# Altium schematic sheet 06_LMS7002M_Power.SchDoc: LMS7002M power supply
size A3 portrait; Organization: Lime Microsystems; Address1: Surrey Tech Centre; Address2: Guildford GU2 7YG; Address3: Surrey; Address4: United Kingdom; Revision: v1.3; SheetNumber: 6; SheetTotal: 9; PageSetup: Record=PageOptions|CenterHorizontal=True|CenterVertical=True|PrintScale=0.73|XCorrection=1.00|YCorrection=1.00|PrintKind=0|BorderSize=5000000|LeftOffset=0|BottomOffset=0|Orientation=1|PaperLength=2970|PaperWidth=2100|Scale=100|PaperSource=7|PrintQuality=-3|MediaType=1|DitherType=10|PrintScaleMode=1|PaperKind=A4|PaperIndex=9
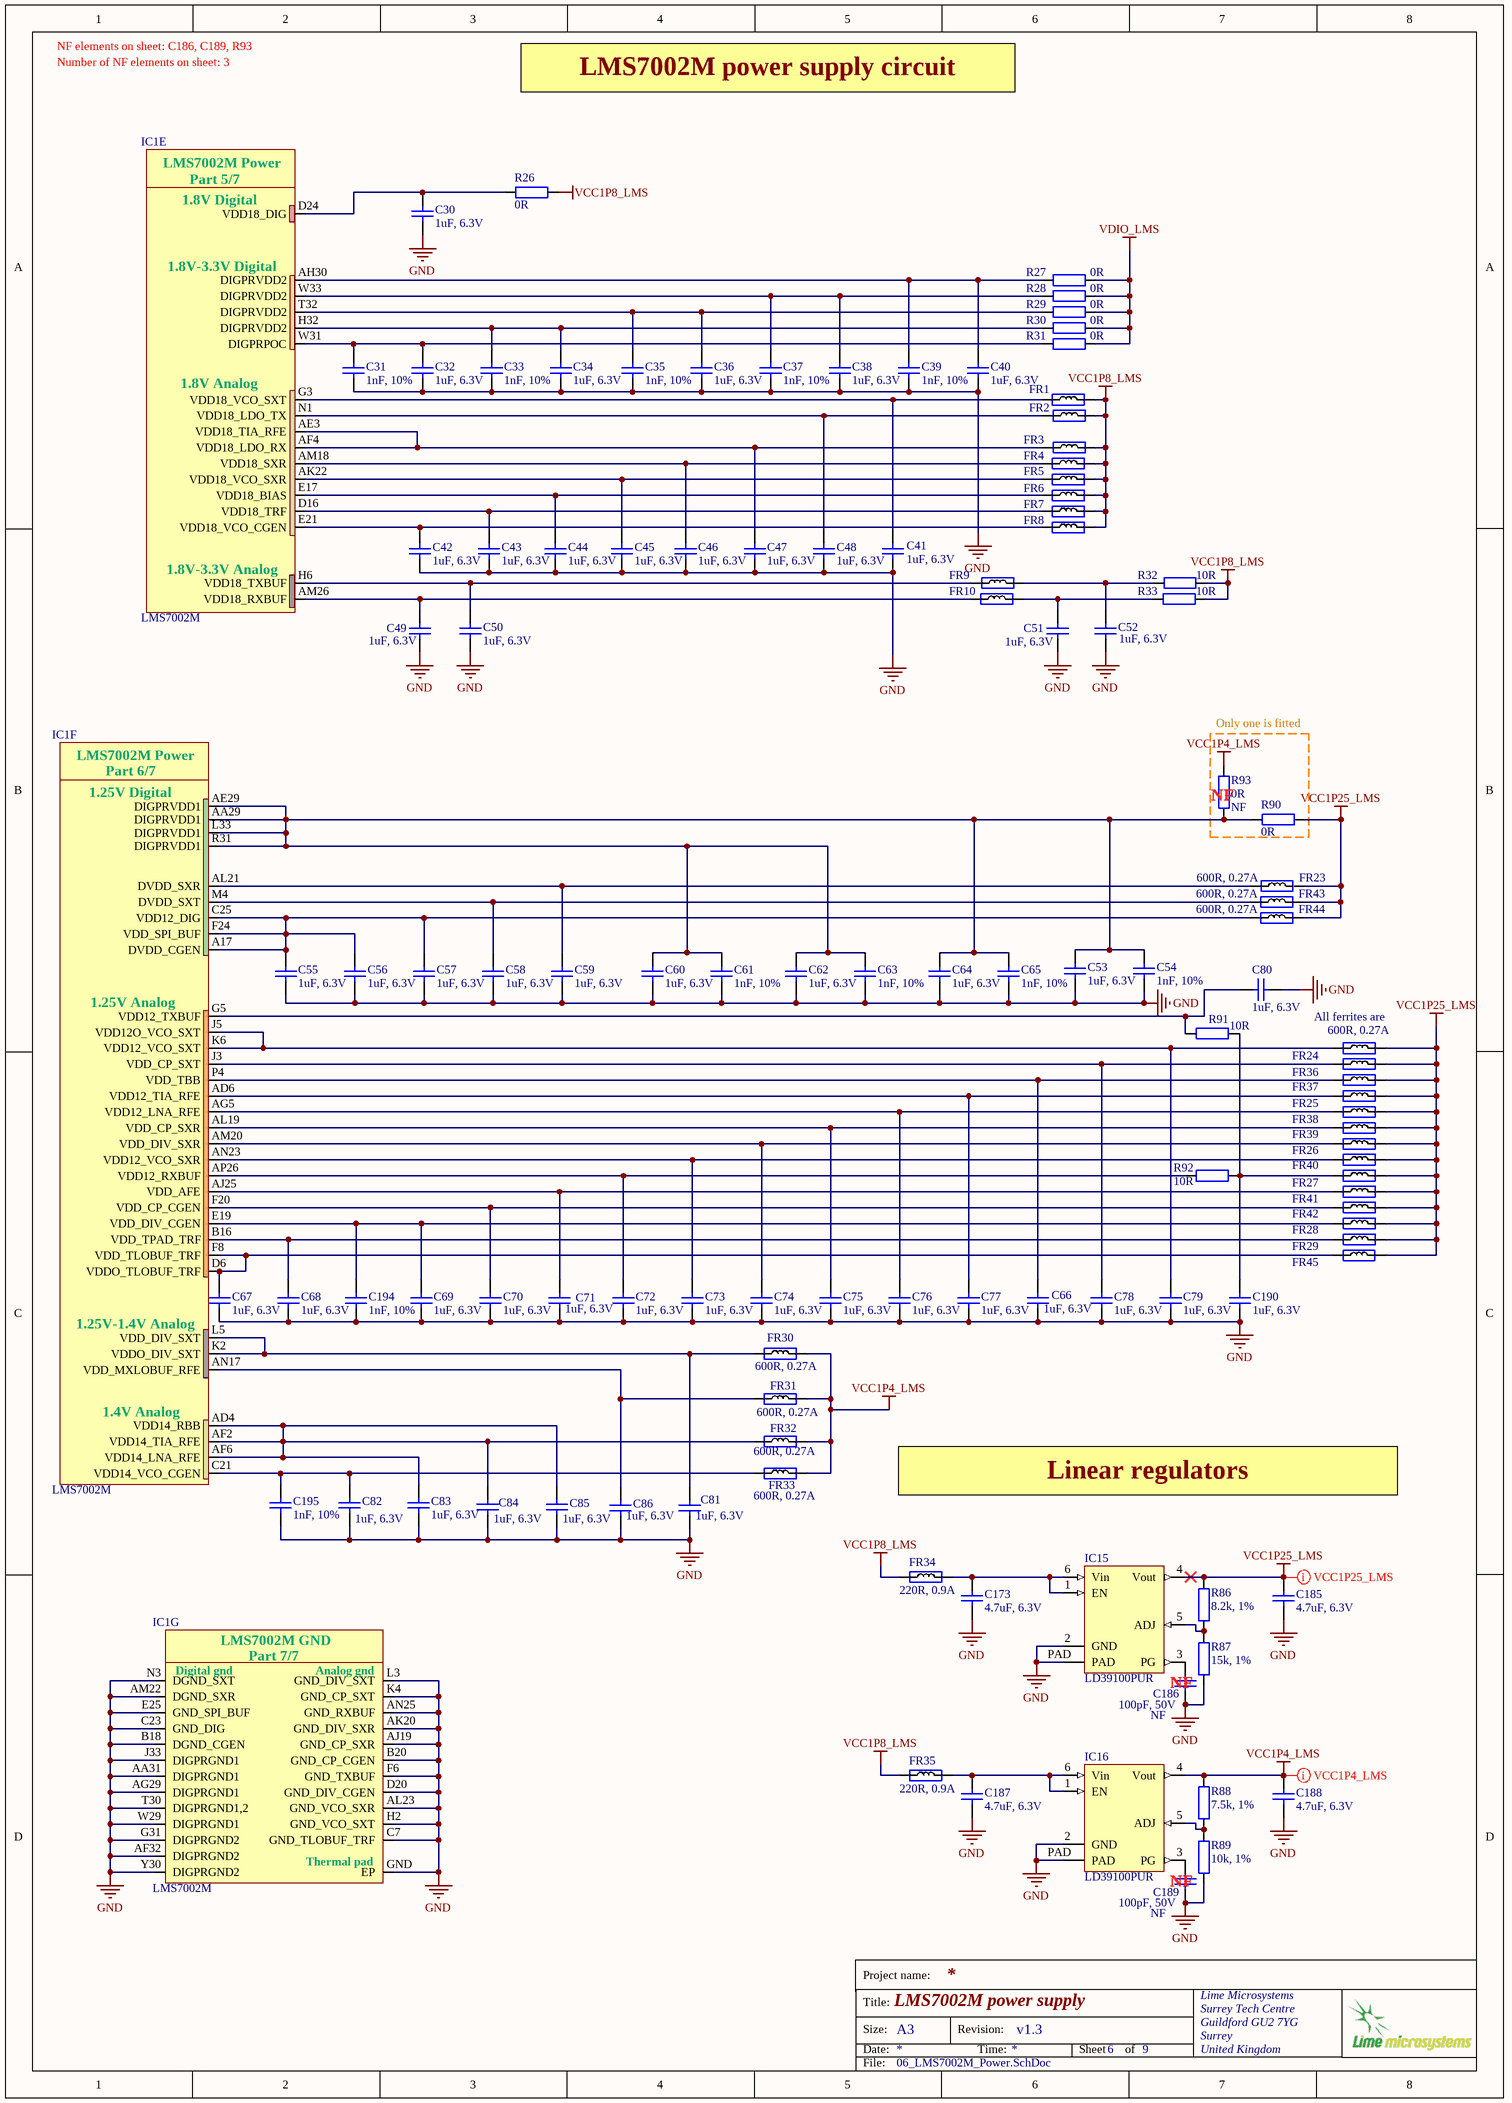
[diagram p0: 06_LMS7002M_Power.SchDoc]

## Parts
C30  1uF, 6.3V  [CAP0201]
C31  1nF, 10%  [CAP0201]
C32  1uF, 6.3V  [CAP0201]
C33  1nF, 10%  [CAP0201]
C34  1uF, 6.3V  [CAP0201]
C35  1nF, 10%  [CAP0201]
C36  1uF, 6.3V  [CAP0201]
C37  1nF, 10%  [CAP0201]
C38  1uF, 6.3V  [CAP0201]
C39  1nF, 10%  [CAP0201]
C40  1uF, 6.3V  [CAP0201]
C41  1uF, 6.3V  [CAP0201]
C42  1uF, 6.3V  [CAP0201]
C43  1uF, 6.3V  [CAP0201]
C44  1uF, 6.3V  [CAP0201]
C45  1uF, 6.3V  [CAP0201]
C46  1uF, 6.3V  [CAP0201]
C47  1uF, 6.3V  [CAP0201]
C48  1uF, 6.3V  [CAP0201]
C49  1uF, 6.3V  [CAP0201]
C50  1uF, 6.3V  [CAP0201]
C51  1uF, 6.3V  [CAP0201]
C52  1uF, 6.3V  [CAP0201]
C53  1uF, 6.3V  [CAP0201]
C54  1nF, 10%  [CAP0201]
C55  1uF, 6.3V  [CAP0201]
C56  1uF, 6.3V  [CAP0201]
C57  1uF, 6.3V  [CAP0201]
C58  1uF, 6.3V  [CAP0201]
C59  1uF, 6.3V  [CAP0201]
C60  1uF, 6.3V  [CAP0201]
C61  1nF, 10%  [CAP0201]
C62  1uF, 6.3V  [CAP0201]
C63  1nF, 10%  [CAP0201]
C64  1uF, 6.3V  [CAP0201]
C65  1nF, 10%  [CAP0201]
C66  1uF, 6.3V  [CAP0201]
C67  1uF, 6.3V  [CAP0201]
C68  1uF, 6.3V  [CAP0201]
C69  1uF, 6.3V  [CAP0201]
C70  1uF, 6.3V  [CAP0201]
C71  1uF, 6.3V  [CAP0201]
C72  1uF, 6.3V  [CAP0201]
C73  1uF, 6.3V  [CAP0201]
C74  1uF, 6.3V  [CAP0201]
C75  1uF, 6.3V  [CAP0201]
C76  1uF, 6.3V  [CAP0201]
C77  1uF, 6.3V  [CAP0201]
C78  1uF, 6.3V  [CAP0201]
C79  1uF, 6.3V  [CAP0201]
C80  1uF, 6.3V  [CAP0201]
C81  1uF, 6.3V  [CAP0201]
C82  1uF, 6.3V  [CAP0201]
C83  1uF, 6.3V  [CAP0201]
C84  1uF, 6.3V  [CAP0201]
C85  1uF, 6.3V  [CAP0201]
C86  1uF, 6.3V  [CAP0201]
C173  4.7uF, 6.3V  [CAP0402]
C185  4.7uF, 6.3V  [CAP0402]
C186  100pF, 50V  Assembly Info: NF  [CAP0402]
C187  4.7uF, 6.3V  [CAP0402]
C188  4.7uF, 6.3V  [CAP0402]
C189  100pF, 50V  Assembly Info: NF  [CAP0402]
C190  1uF, 6.3V  [CAP0201]
C194  1nF, 10%  [CAP0201]
C195  1nF, 10%  [CAP0201]
FR1  600R, 0.27A  [RES0201]  (value not drawn)
FR2  600R, 0.27A  [RES0201]  (value not drawn)
FR3  600R, 0.27A  [RES0201]  (value not drawn)
FR4  600R, 0.27A  [RES0201]  (value not drawn)
FR5  600R, 0.27A  [RES0201]  (value not drawn)
FR6  600R, 0.27A  [RES0201]  (value not drawn)
FR7  600R, 0.27A  [RES0201]  (value not drawn)
FR8  600R, 0.27A  [RES0201]  (value not drawn)
FR9  600R, 0.27A  [RES0201]  (value not drawn)
FR10  600R, 0.27A  [RES0201]  (value not drawn)
FR23  600R, 0.27A  [RES0201]
FR24  600R, 0.27A  [RES0201]
FR25  600R, 0.27A  [RES0201]  (value not drawn)
FR26  600R, 0.27A  [RES0201]  (value not drawn)
FR27  600R, 0.27A  [RES0201]  (value not drawn)
FR28  600R, 0.27A  [RES0201]  (value not drawn)
FR29  600R, 0.27A  [RES0201]  (value not drawn)
FR30  600R, 0.27A  [RES0201]
FR31  600R, 0.27A  [RES0201]
FR32  600R, 0.27A  [RES0201]
FR33  600R, 0.27A  [RES0201]
FR34  220R, 0.9A  [RES0402]
FR35  220R, 0.9A  [RES0402]
FR36  600R, 0.27A  [RES0201]  (value not drawn)
FR37  600R, 0.27A  [RES0201]  (value not drawn)
FR38  600R, 0.27A  [RES0201]  (value not drawn)
FR39  600R, 0.27A  [RES0201]  (value not drawn)
FR40  600R, 0.27A  [RES0201]  (value not drawn)
FR41  600R, 0.27A  [RES0201]  (value not drawn)
FR42  600R, 0.27A  [RES0201]  (value not drawn)
FR43  600R, 0.27A  [RES0201]
FR44  600R, 0.27A  [RES0201]
FR45  600R, 0.27A  [RES0201]  (value not drawn)
IC1  LMS7002M  [LMS7002M_v5]  (parts E,F,G of 7)
IC15  LD39100PUR  [LD39100PUR]
IC16  LD39100PUR  [LD39100PUR]
R26  0R  [RES0201]
R27  0R  [RES0402]
R28  0R  [RES0402]
R29  0R  [RES0402]
R30  0R  [RES0402]
R31  0R  [RES0402]
R32  10R  [RES0201]
R33  10R  [RES0201]
R86  8.2k, 1%  [RES0402]
R87  15k, 1%  [RES0402]
R88  7.5k, 1%  [RES0402]
R89  10k, 1%  [RES0402]
R90  0R  [RES0402]
R91  10R  [RES0201]
R92  10R  [RES0201]
R93  0R  Assembly Info: NF  [RES0402]

## Blocks framed on the sheet
Only one is fitted: R90 R93

## Nets
GND: C30.2 C31.2 C32.2 C33.2 C34.2 C35.2 C36.2 C37.2 C38.2 C39.2 C40.2 C41.2 C42.2 C43.2 C44.2 C45.2 C46.2 C47.2 C48.2 C49.2 C50.2 C51.2 C52.2 C53.2 C54.2 C55.2 C56.2 C57.2 C58.1 C59.2 C60.2 C61.2 C62.2 C63.2 C64.2 C65.2 C66.2 C67.2 C68.2 C69.2 C70.1 C71.2 C72.2 C73.2 C74.2 C75.2 C76.2 C77.1 C78.2 C79.1 C80.2 C81.2 C82.2 C83.2 C84.2 C85.2 C86.2 C173.1 C185.1 C186.1 C187.1 C188.1 C189.1 C190.1 C194.2 C195.2 IC1.AA31(DIGPRGND1) IC1.AF32(DIGPRGND2) IC1.AG29(DIGPRGND1) IC1.AJ19(GND_CP_SXR) IC1.AK20(GND_DIV_SXR) IC1.AL23(GND_VCO_SXR) IC1.AM22(DGND_SXR) IC1.AN25(GND_RXBUF) IC1.B18(DGND_CGEN) IC1.B20(GND_CP_CGEN) IC1.C7(GND_TLOBUF_TRF) IC1.C23(GND_DIG) IC1.D20(GND_DIV_CGEN) IC1.E25(GND_SPI_BUF) IC1.F6(GND_TXBUF) IC1.G31(DIGPRGND2) IC1.GND(EP) IC1.H2(GND_VCO_SXT) IC1.J33(DIGPRGND1) IC1.K4(GND_CP_SXT) IC1.L3(GND_DIV_SXT) IC1.N3(DGND_SXT) IC1.T30(DIGPRGND1,2) IC1.W29(DIGPRGND1) IC1.Y30(DIGPRGND2) IC15.2(GND) IC15.PAD IC16.2(GND) IC16.PAD R87.1 R89.1
VCC1P4_LMS: C188.2 FR30.2 FR31.2 FR32.2 FR33.2 IC16.4(Vout) R88.2 R93.1
VCC1P8_LMS: FR1.2 FR2.1 FR3.1 FR4.2 FR5.2 FR6.2 FR7.2 FR8.2 FR34.1 FR35.1 R26.2 R32.2 R33.1
VCC1P25_LMS: C185.2 FR23.2 FR24.2 FR25.2 FR26.2 FR27.2 FR28.2 FR29.2 FR36.2 FR37.2 FR38.2 FR39.2 FR40.2 FR41.2 FR42.2 FR43.2 FR44.2 FR45.2 IC15.4(Vout) R86.2 R90.1
VDIO_LMS: R27.1 R28.1 R29.1 R30.1 R31.1
NetC30_1: C30.1 IC1.D24(VDD18_DIG) R26.1
NetC31_1: C31.1 C32.1 IC1.W31(DIGPRPOC) R31.2
NetC33_1: C33.1 C34.1 IC1.H32(DIGPRVDD2) R30.2
NetC35_1: C35.1 C36.1 IC1.T32(DIGPRVDD2) R29.2
NetC37_1: C37.1 C38.1 IC1.W33(DIGPRVDD2) R28.2
NetC39_1: C39.1 C40.1 IC1.AH30(DIGPRVDD2) R27.2
NetC41_1: C41.1 FR1.1 IC1.G3(VDD18_VCO_SXT)
NetC42_1: C42.1 FR8.1 IC1.E21(VDD18_VCO_CGEN)
NetC43_1: C43.1 FR7.1 IC1.D16(VDD18_TRF)
NetC44_1: C44.1 FR6.1 IC1.E17(VDD18_BIAS)
NetC45_1: C45.1 FR5.1 IC1.AK22(VDD18_VCO_SXR)
NetC46_1: C46.1 FR4.1 IC1.AM18(VDD18_SXR)
NetC47_1: C47.1 FR3.2 IC1.AE3(VDD18_TIA_RFE) IC1.AF4(VDD18_LDO_RX)
NetC48_1: C48.1 FR2.2 IC1.N1(VDD18_LDO_TX)
NetC49_1: C49.1 FR10.1 IC1.AM26(VDD18_RXBUF)
NetC50_1: C50.1 FR9.2 IC1.H6(VDD18_TXBUF)
NetC51_1: C51.1 FR10.2 R33.2
NetC52_1: C52.1 FR9.1 R32.1
NetC53_1: C53.1 C54.1 C60.1 C61.1 C62.1 C63.1 C64.1 C65.1 IC1.AA29(DIGPRVDD1) IC1.AE29(DIGPRVDD1) IC1.L33(DIGPRVDD1) IC1.R31(DIGPRVDD1) R90.2 R93.2
NetC55_1: C55.1 C56.1 C57.1 FR44.1 IC1.A17(DVDD_CGEN) IC1.C25(VDD12_DIG) IC1.F24(VDD_SPI_BUF)
NetC58_2: C58.2 FR43.1 IC1.M4(DVDD_SXT)
NetC59_1: C59.1 FR23.1 IC1.AL21(DVDD_SXR)
NetC66_1: C66.1 FR37.1 IC1.P4(VDD_TBB)
NetC67_1: C67.1 FR45.1 IC1.D6(VDDO_TLOBUF_TRF) IC1.F8(VDD_TLOBUF_TRF)
NetC68_1: C68.1 FR29.1 IC1.B16(VDD_TPAD_TRF)
NetC69_1: C69.1 C194.1 FR28.1 IC1.E19(VDD_DIV_CGEN)
NetC70_2: C70.2 FR42.1 IC1.F20(VDD_CP_CGEN)
NetC71_1: C71.1 FR41.1 IC1.AJ25(VDD_AFE)
NetC72_1: C72.1 IC1.AP26(VDD12_RXBUF) R92.1
NetC73_1: C73.1 FR40.1 IC1.AN23(VDD12_VCO_SXR)
NetC74_1: C74.1 FR26.1 IC1.AM20(VDD_DIV_SXR)
NetC75_1: C75.1 FR39.1 IC1.AL19(VDD_CP_SXR)
NetC76_1: C76.1 FR38.1 IC1.AG5(VDD12_LNA_RFE)
NetC77_2: C77.2 FR25.1 IC1.AD6(VDD12_TIA_RFE)
NetC78_1: C78.1 FR36.1 IC1.J3(VDD_CP_SXT)
NetC79_2: C79.2 FR24.1 IC1.J5(VDD12O_VCO_SXT) IC1.K6(VDD12_VCO_SXT)
NetC80_1: C80.1 IC1.G5(VDD12_TXBUF) R91.1
NetC81_1: C81.1 FR30.1 IC1.K2(VDDO_DIV_SXT) IC1.L5(VDD_DIV_SXT)
NetC82_1: C82.1 C195.1 FR33.1 IC1.C21(VDD14_VCO_CGEN)
NetC83_1: C83.1 C84.1 C85.1 FR32.1 IC1.AD4(VDD14_RBB) IC1.AF2(VDD14_TIA_RFE) IC1.AF6(VDD14_LNA_RFE)
NetC86_1: C86.1 FR31.1 IC1.AN17(VDD_MXLOBUF_RFE)
NetC173_2: C173.2 FR34.2 IC15.1(EN) IC15.6(Vin)
NetC186_2: C186.2 IC15.3(PG)
NetC187_2: C187.2 FR35.2 IC16.1(EN) IC16.6(Vin)
NetC189_2: C189.2 IC16.3(PG)
NetC190_2: C190.2 FR27.1 R91.2 R92.2
NetIC15_5: IC15.5(ADJ) R86.1 R87.2
NetIC16_5: IC16.5(ADJ) R88.1 R89.2

## Layout directives
net class VCC1P25_LMS: VCC1P25_LMS
net class VCC1P4_LMS: VCC1P4_LMS

## Notes on the sheet
- Number of NF elements on sheet: 3
- NF elements on sheet: C186, C189, R93
- LMS7002M power supply circuit
- (near R93) NF
- (near FR24) All ferrites are
- Linear regulators
- NF
- Project name:
- Title:
- Size:
- Date:
- A3
- Revision:
- Time:
- Sheet
- of
- File:
- (in symbol LMS7002Mr3, part E) LMS7002M Power; Part 5/7; 1.8V Digital; 1.8V-3.3V Digital; 1.8V Analog; 1.8V-3.3V Analog
- (in symbol LMS7002Mr3, part F) LMS7002M Power; Part 6/7; 1.25V Digital; 1.25V Analog; 1.25V-1.4V Analog; 1.4V Analog
- (in symbol LMS7002Mr3, part G) LMS7002M GND; Part 7/7; Digital gnd; Analog gnd; Thermal pad

## Library data of the parts
C30 C32 C34 C36 C38 C40-C53 C55-C60 C62 C64 C66-C86 C190 = Cap_0402: Manufacturer: TDK Corporation; Manufacturer Part Number 1: JMK063ABJ105MP-F; Part Description: 1µF ±20% 6.3V X5R Ceramic Capacitor -55°C ~ 85°C Surface Mount, MLCC 0201 (0603 Metric) 0.024" L x 0.012" W (0.60mm x 0.30mm); Value: 1uF, 20%; Tolerance: ±20%; Capacitance: 1.0µF; Temperature Coefficient: X5R; Supplier 1: Digi-Key; Supplier Part Number 1: 587-5864-2-ND; Applications: General Purpose; Features: -; Lead Style: -; Ratings: -; Thickness (Max): -; Lead Spacing: -; Height - Seated (Max): -; Size / Dimension: 0.024" L x 0.012" W (0.60mm x 0.30mm); Mounting Type: Surface Mount, MLCC; Operating Temperature: -55°C ~ 85°C; Package / Case: 0201 (0603 Metric); Packaging: Cut Tape (CT); Voltage - Rated: 6.3V; Category: Capacitors; RoHS: RoHS Compliant
C31 C33 C35 C37 C39 C54 C61 C63 C65 C194 C195 = Cap_0402: Manufacturer Part Number 1: C0603X7R1E102K030BA; Manufacturer: TDK Corporation; Part Description: 1000pF ±10% 25V X7R Ceramic Capacitor -55°C ~ 125°C Surface Mount, MLCC 0201 (0603 Metric) 0.024" L x 0.012" W (0.60mm x 0.30mm); Voltage - Rated: 25V; Temperature Coefficient: X7R; Capacitance: 1000pF; Value: 1nF, 10%; Supplier 1: Digi-Key; Supplier Part Number 1: 445-7275-1-ND; Features: -; Package / Case: 0201 (0603 Metric); Lead Spacing: -; Mounting Type: Surface Mount, MLCC; Lead Style: -; Height - Seated (Max): -; Operating Temperature: -55°C ~ 125°C; Tolerance: ±10%; Size / Dimension: 0.024" L x 0.012" W (0.60mm x 0.30mm); Applications: General Purpose; Ratings: -; Thickness (Max): 0.013" (0.33mm); RoHS: RoHS Compliant; Packaging: Cut Tape (CT); Category: Capacitors
C173 C185 C187 C188 = Cap_0402: Manufacturer: Murata Electronics North America; Manufacturer Part Number 1: GRM155R60J475ME87D; Part Description: 4.7µF ±20% 6.3V X5R Ceramic Capacitor -55°C ~ 85°C Surface Mount, MLCC 0402 (1005 Metric) 0.039" L x 0.020" W (1.00mm x 0.50mm); Tolerance: ±20%; Capacitance: 4.7µF; Temperature Coefficient: X5R; Lead Style: -; Ratings: -; Height - Seated (Max): -; Thickness (Max): 0.022" (0.55mm); Voltage - Rated: 6.3V; Packaging: Cut Tape (CT); Lead Spacing: -; Category: Capacitors; Supplier Part Number 1: 490-5408-1-ND; Applications: General Purpose; Operating Temperature: -55°C ~ 85°C; Mounting Type: Surface Mount, MLCC; Features: Derating Recommended; RoHS: RoHS Compliant; Supplier 1: Digi-Key; Package / Case: 0402 (1005 Metric); Size / Dimension: 0.039" L x 0.020" W (1.00mm x 0.50mm); Value: 4.7uF, 6.3V
C186 C189 = Cap_0402: Manufacturer Part Number 1: CC0402JRNPO9BN101; Manufacturer: Yageo; Part Description: 100pF ±5% 50V C0G, NP0 Ceramic Capacitor -55°C ~ 125°C Surface Mount, MLCC 0402 (1005 Metric) 0.039" L x 0.020" W (1.00mm x 0.50mm); Temperature Coefficient: C0G, NP0; Tolerance: ±5%; Value: 100pF, 50V; Supplier 1: Digi-Key; Supplier Part Number 1: 311-1024-1-ND; RoHS: RoHS Compliant; Category: Capacitors; Applications: General Purpose; Mounting Type: Surface Mount, MLCC; Capacitance: 100pF; Ratings: -; Packaging: Cut Tape (CT); Voltage - Rated: 50V; Size / Dimension: 0.039" L x 0.020" W (1.00mm x 0.50mm); Height - Seated (Max): -; Package / Case: 0402 (1005 Metric); Operating Temperature: -55°C ~ 125°C; Features: -; Lead Spacing: -; Lead Style: -; Thickness (Max): 0.022" (0.55mm)
FR1-FR10 FR23-FR33 FR36-FR45 = Ferrite: Manufacturer Part Number 1: BK0603TS601-T; Manufacturer: Taiyo Yuden; Part Description: FERRITE BEAD 600 OHM 0201 1LN; DC Resistance (DCR): 750 mOhm Max; Filter Type: Differential Mode - Single; Impedance @ Frequency: 600 Ohm @ 100MHz; Current Rating: 270mA; Value: 600R@100MHz; Supplier 1: Digi-Key; Supplier Part Number 1: 587-3277-1-ND; Size / Dimension: 0.024" L x 0.012" W (0.60mm x 0.30mm); Package / Case: 0201 (0603 Metric); Height (Max): 0.013" (0.33mm); Mounting Type: Surface Mount; Packaging: Cut Tape (CT); RoHS: RoHS Compliant; Category: Filters
FR34 FR35 = Ferrite: Manufacturer: TDK Corporation; Manufacturer Part Number 1: MPZ1005S221ET000; Part Description: FERRITE BEAD 220 OHM 0402 1LN; Impedance @ Frequency: 220 Ohm @ 100MHz; Current Rating: 900mA; DC Resistance (DCR): 220 mOhm Max; Supplier 1: Digi-Key; Package / Case: 0402 (1005 Metric); Category: Filters; Supplier Part Number 1: 445-9329-2-ND; Value: 220R, 0.9A
IC1 = LMS7002Mr3: Schematic symbol revision 3. Default footprint - 0.31mm pad; Manufacturer: Lime Microsystems; Part Description: IC FPRF Transceiver LMS7002M; 261 pin aQFN; Supplier 1: Lime Microsystems; Supplier Part Number 1: LMS7002M; Manufacturer Part Number 1: LMS7002M
IC15 IC16 = LD39100PUR: Manufacturer: STMicroelectronics; Part Description: Linear Voltage Regulator IC Positive Adjustable Output 0.8 V ~ 4.5 V 1A 6-DFN (3x3); Output Configuration: Positive; Output Type: Adjustable; Voltage - Input (Max): 5.5V; Voltage - Output (Min/Fixed): 0.8V; Voltage - Output (Max): 4.6V; Voltage Dropout (Max): 0.4V @ 1A; Current - Output: 1A; Current - Supply: 50µA ~ 300µA; PSRR: 70dB ~ 65dB (1kHz ~ 10kHz); Control Features: Enable, Power Good; Protection Features: Over Current, Over Temperature, Short Circuit; Supplier 1: Digi-Key; Manufacturer Part Number 1: LD39100PUR; RoHS: RoHS Compliant; Category: Integrated Circuits (ICs); Stock 1: 27970; Pricing 1: 1=0.85, 10=0.76, 100=0.5923, 500=0.48926, 1000=0.38625 (USD); Packaging: Cut Tape (CT); Part Status: Active; Operating Temperature: -40°C ~ 125°C; Mounting Type: Surface Mount; Package / Case: 6-VDFN Exposed Pad; Supplier Device Package: 6-DFN (3x3); ComponentLink1URL: http://www.st.com/content/ccc/resource/technical/document/datasheet/72/02/e5/ee/df/36/40/5e/CD00233788.pdf/files/CD00233788.pdf/jcr:content/translations/en.CD00233788.pdf; ComponentLink1Description: http://www.st.com/content/ccc/resource/technical/document/datasheet/72/02/e5/ee/df/36/40/5e/CD00233788.pdf/files/CD00233788.pdf/jcr:content/translations/en.CD00233788.pdf; Supplier Part Number 1: 497-11013-1-ND
R26 = Res_0402: Manufacturer Part Number 1: RC0201FR-070RL; Manufacturer: Rohm Semiconductor; Part Description: RES SMD 0.0OHM JUMPER 1/20W 0201; Resistance (Ohms): 0.0; Power (Watts): 0.05W, 1/20W; Tolerance: Jumper; Value: 0R; Supplier 1: Digi-Key; Supplier Part Number 1: 311-0.0MCT-ND; Number of Terminations: 2; Operating Temperature: -55°C ~ 125°C; Package / Case: 0201 (0603 Metric); Height: 0.010" (0.26mm); Supplier Device Package: 0201 (0603 Metric); Size / Dimension: 0.024" L x 0.012" W (0.60mm x 0.30mm); Temperature Coefficient: -; Category: Resistors; Features: -; RoHS: RoHS Compliant; Composition: Thick Film; Packaging: Cut Tape (CT)
R27-R31 R90 R93 = Res_0402: Manufacturer Part Number 1: RC0402JR-070RL; Manufacturer: Yageo; Part Description: RES SMD 0.0OHM JUMPER 1/16W 0402; Resistance (Ohms): 0.0; Tolerance: Jumper; Power (Watts): 0.063W, 1/16W; Value: 0R; Supplier 1: Digi-Key; Supplier Part Number 1: 311-0.0JRTR-ND; Category: Resistors; Temperature Coefficient: -; Features: Moisture Resistant; Supplier Device Package: 0402; Height: 0.016" (0.40mm); Package / Case: 0402 (1005 Metric); Operating Temperature: -55°C ~ 155°C; Size / Dimension: 0.039" L x 0.020" W (1.00mm x 0.50mm); Composition: Thick Film; Packaging: Tape & Reel (TR); Number of Terminations: 2; RoHS: RoHS Compliant
R32 R33 = Res_0402: Manufacturer: Panasonic Electronic Components; Manufacturer Part Number: ERJ-1GEF10R0C; Part Description: RES SMD 10 OHM 1% 1/20W 0201; Power (Watts): 0.05W, 1/20W; Resistance (Ohms): 10; Tolerance: ±1%; Temperature Coefficient: ±200ppm/°C; Value: 10R; Supplier 1: Digi-Key; Supplier Part Number 1: P10.0ABCT-ND; Package / Case: 0201 (0603 Metric); Height: 0.010" (0.26mm); Supplier Device Package: 0201; Packaging: Cut Tape (CT); Composition: Thick Film; Category: Resistors; Number of Terminations: 2; Size / Dimension: 0.024" L x 0.012" W (0.60mm x 0.30mm); Operating Temperature: -55°C ~ 125°C; Features: -; RoHS: RoHS Compliant
R86 = Res_0402: Manufacturer: Yageo; Part Description: RES SMD 8.2K OHM 1% 1/16W 0402; Manufacturer Part Number 1: RC0402FR-078K2L; Power (Watts): 0.063W, 1/16W; Temperature Coefficient: ±100ppm/°C; Value: 8.2k, 1%; Supplier 1: Digi-Key; Supplier Device Package: 0402; Package / Case: 0402 (1005 Metric); Height: 0.016" (0.40mm); Supplier Part Number 1: 311-8.20KLRCT-ND; Number of Terminations: 2; Operating Temperature: -55°C ~ 155°C; Resistance (Ohms): 8.2k; Size / Dimension: 0.039" L x 0.020" W (1.00mm x 0.50mm); Composition: Thick Film; Category: Resistors; Tolerance: ±1%; Features: Moisture Resistant; RoHS: RoHS Compliant; Packaging: Cut Tape (CT)
R87 = Res_0402: Manufacturer: Yageo; Manufacturer Part Number 1: RC0402FR-0715KL; Part Description: RES SMD 15K OHM 1% 1/16W 0402; Temperature Coefficient: ±100ppm/°C; Power (Watts): 0.063W, 1/16W; Value: 15k, 1%; Category: Resistors; Number of Terminations: 2; RoHS: RoHS Compliant; Features: Moisture Resistant; Operating Temperature: -55°C ~ 155°C; Tolerance: ±1%; Composition: Thick Film; Resistance (Ohms): 15k; Failure Rate: -; Height - Seated (Max): 0.016" (0.40mm); Packaging: Cut Tape (CT); Supplier Device Package: 0402; Size / Dimension: 0.039" L x 0.020" W (1.00mm x 0.50mm); Package / Case: 0402 (1005 Metric); Part Status: Active; Supplier 1: Digi-Key; Supplier Part Number 1: 311-15.0KLRCT-ND
R88 = Res_0402: Manufacturer: Yageo; Manufacturer Part Number 1: RC0402FR-077K5L; Part Description: ±1% 0.063W, 1/16W Chip Resistor 0402 (1005 Metric) Automotive AEC-Q200, Moisture Resistant Thick Film; Power (Watts): 0.063W, 1/16W; Temperature Coefficient: ±100ppm/°C; Value: 7.5k, 1%; Operating Temperature: -55°C ~ 155°C; Height - Seated (Max): 0.016" (0.40mm); Supplier 1: Digi-Key; Composition: Thick Film; Packaging: Cut Tape (CT); Tolerance: ±1%; Category: Resistors; Part Status: Active; Failure Rate: -; Supplier Device Package: 0402; Features: Moisture Resistant; Supplier Part Number 1: YAG3512CT-ND; RoHS: RoHS Compliant; Package / Case: 0402 (1005 Metric); Size / Dimension: 0.039" L x 0.020" W (1.00mm x 0.50mm)
R89 = Res_0402: Manufacturer: Yageo; Manufacturer Part Number 1: RC0402FR-0710KL; Part Description: RES SMD 10K OHM 1% 1/16W 0402; Temperature Coefficient: ±100ppm/°C; Power (Watts): 0.063W, 1/16W; Value: 10k, 1%; Supplier 1: Digi-Key; Supplier Part Number 1: 311-10.0KLRTR-ND; Resistance (Ohms): 10k; Packaging: Tape & Reel (TR); RoHS: RoHS Compliant; Package / Case: 0402 (1005 Metric); Tolerance: ±1%; Operating Temperature: -55°C ~ 155°C; Size / Dimension: 0.039" L x 0.020" W (1.00mm x 0.50mm); Number of Terminations: 2; Category: Resistors; Height: 0.016" (0.40mm); Supplier Device Package: 0402; Features: Moisture Resistant; Composition: Thick Film
R91 R92 = Res_0402: Manufacturer: Panasonic Electronic Components; Part Description: RES SMD 10 OHM 1% 1/20W 0201; Manufacturer Part Number 1: ERJ-1GEF10R0C; Power (Watts): 0.05W, 1/20W; Resistance (Ohms): 10; Tolerance: ±1%; Temperature Coefficient: ±200ppm/°C; Value: 10R; Supplier 1: Digi-Key; Supplier Part Number 1: P10.0ABCT-ND; Package / Case: 0201 (0603 Metric); Height: 0.010" (0.26mm); Supplier Device Package: 0201; Packaging: Cut Tape (CT); Composition: Thick Film; Category: Resistors; Number of Terminations: 2; Size / Dimension: 0.024" L x 0.012" W (0.60mm x 0.30mm); Operating Temperature: -55°C ~ 125°C; Features: -; RoHS: RoHS Compliant